# Altium schematic sheet B293A MiRLIN Integrated PIC32.SchDoc
size A3
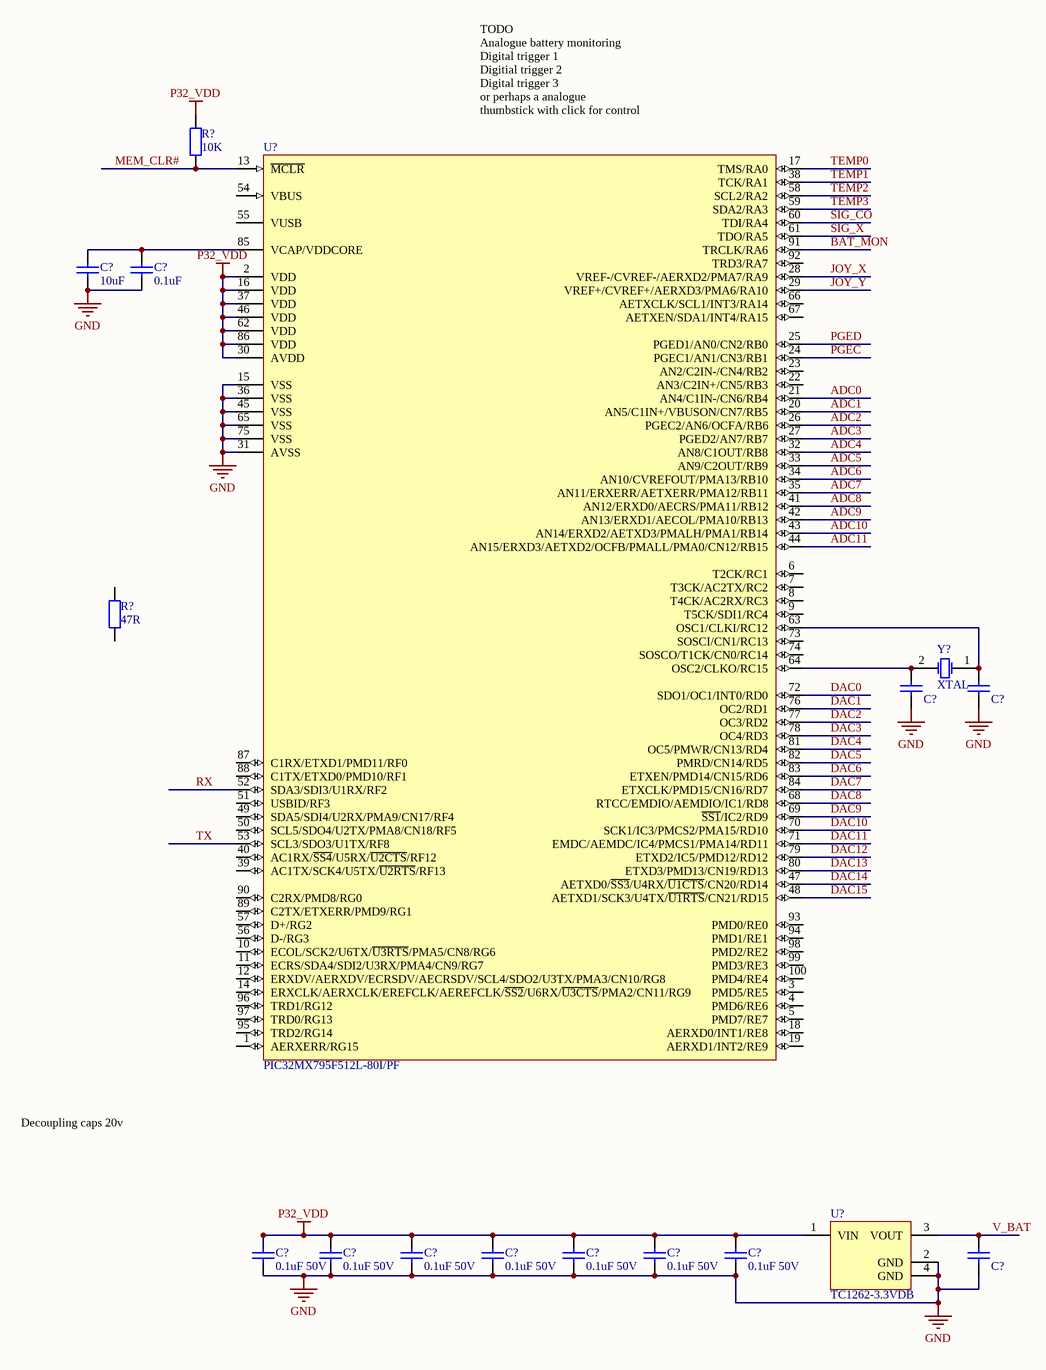
[diagram p0: B293A MiRLIN Integrated PIC32.SchDoc]

## Parts
(Parts that share a designator on the sheet are numbered #1, #2 ... from top to bottom, then left to right.)
C?#1  10uF  [1206]
C?#2  0.1uF  [1206]
C?#3  CAP 18pF 50V 0805(2012)  [CAPC0805(2012)75_M]  (value not drawn)
C?#4  CAP 18pF 50V 0805(2012)  [CAPC0805(2012)75_M]  (value not drawn)
C?#5  0.1uF 50V  [1206]
C?#6  0.1uF 50V  [1206]
C?#7  0.1uF 50V  [1206]
C?#8  0.1uF 50V  [1206]
C?#9  0.1uF 50V  [1206]
C?#10  0.1uF 50V  [1206]
C?#11  0.1uF 50V  [1206]
C?#12  CAP 10uF 16V 1206(3216)  [CAPC1206(3216)130_L]  (value not drawn)
R?#1  10K  [1206]
R?#2  47R  [1206]
U?#1  PIC32MX795F512L-80I/PF  [TQFP-PF100_M]
U?#2  TC1262-3.3VDB  [SOT-223-DB3_L]
Y?  XTAL  [XTL SMD]

## Nets
GND: C?#1.2 C?#2.2 C?#3.1 C?#4.1 C?#5.2 C?#6.2 C?#7.2 C?#8.2 C?#9.2 C?#10.2 C?#11.2 C?#12.2 U?#1.15(VSS) U?#1.31(AVSS) U?#1.36(VSS) U?#1.45(VSS) U?#1.65(VSS) U?#1.75(VSS) U?#2.2(GND) U?#2.4(GND)
P32_VDD: C?#5.1 C?#6.1 C?#7.1 C?#8.1 C?#9.1 C?#10.1 C?#11.1 R?#1.1 U?#1.2(VDD) U?#1.16(VDD) U?#1.30(AVDD) U?#1.37(VDD) U?#1.46(VDD) U?#1.62(VDD) U?#1.86(VDD) U?#2.1(VIN)
ADC0: U?#1.21(AN4/C1IN-/CN6/RB4)
ADC1: U?#1.20(AN5/C1IN+/VBUSON/CN7/RB5)
ADC2: U?#1.26(PGEC2/AN6/OCFA/RB6)
ADC3: U?#1.27(PGED2/AN7/RB7)
ADC4: U?#1.32(AN8/C1OUT/RB8)
ADC5: U?#1.33(AN9/C2OUT/RB9)
ADC6: U?#1.34(AN10/CVREFOUT/PMA13/RB10)
ADC7: U?#1.35(AN11/ERXERR/AETXERR/PMA12/RB11)
ADC8: U?#1.41(AN12/ERXD0/AECRS/PMA11/RB12)
ADC9: U?#1.42(AN13/ERXD1/AECOL/PMA10/RB13)
ADC10: U?#1.43(AN14/ERXD2/AETXD3/PMALH/PMA1/RB14)
ADC11: U?#1.44(AN15/ERXD3/AETXD2/OCFB/PMALL/PMA0/CN12/RB15)
BAT_MON: U?#1.91(TRCLK/RA6)
DAC0: U?#1.72(SDO1/OC1/INT0/RD0)
DAC1: U?#1.76(OC2/RD1)
DAC2: U?#1.77(OC3/RD2)
DAC3: U?#1.78(OC4/RD3)
DAC4: U?#1.81(OC5/PMWR/CN13/RD4)
DAC5: U?#1.82(PMRD/CN14/RD5)
DAC6: U?#1.83(ETXEN/PMD14/CN15/RD6)
DAC7: U?#1.84(ETXCLK/PMD15/CN16/RD7)
DAC8: U?#1.68(RTCC/EMDIO/AEMDIO/IC1/RD8)
DAC9: U?#1.69(~{SS1}/IC2/RD9)
DAC10: U?#1.70(SCK1/IC3/PMCS2/PMA15/RD10)
DAC11: U?#1.71(EMDC/AEMDC/IC4/PMCS1/PMA14/RD11)
DAC12: U?#1.79(ETXD2/IC5/PMD12/RD12)
DAC13: U?#1.80(ETXD3/PMD13/CN19/RD13)
DAC14: U?#1.47(AETXD0/~{SS3}/U4RX/~{U1CTS}/CN20/RD14)
DAC15: U?#1.48(AETXD1/SCK3/U4TX/~{U1RTS}/CN21/RD15)
JOY_X: U?#1.28(VREF-/CVREF-/AERXD2/PMA7/RA9)
JOY_Y: U?#1.29(VREF+/CVREF+/AERXD3/PMA6/RA10)
MEM_CLR#: R?#1.2 U?#1.13(~{MCLR})
PGEC: U?#1.24(PGEC1/AN1/CN3/RB1)
PGED: U?#1.25(PGED1/AN0/CN2/RB0)
RX: U?#1.52(SDA3/SDI3/U1RX/RF2)
SIG_CO: U?#1.60(TDI/RA4)
SIG_X: U?#1.61(TDO/RA5)
TEMP0: U?#1.17(TMS/RA0)
TEMP1: U?#1.38(TCK/RA1)
TEMP2: U?#1.58(SCL2/RA2)
TEMP3: U?#1.59(SDA2/RA3)
TX: U?#1.53(SCL3/SDO3/U1TX/RF8)
V_BAT: C?#12.1 U?#2.3(VOUT)
NetC?#1_1: C?#1.1 C?#2.1 U?#1.85(VCAP/VDDCORE)
NetC?#3_2: C?#3.2 U?#1.64(OSC2/CLKO/RC15) Y?.2(OSC2)
NetC?#4_2: C?#4.2 U?#1.63(OSC1/CLKI/RC12) Y?.1(OSC1)

Not connected (* = marked no-connect by the designer): R?#2 1 2; U?#1 1(AERXERR/RG15) 3(PMD5/RE5) 4(PMD6/RE6) 5(PMD7/RE7) 6(T2CK/RC1) 7(T3CK/AC2TX/RC2) 8(T4CK/AC2RX/RC3) 9(T5CK/SDI1/RC4) 10(ECOL/SCK2/U6TX/~{U3RTS}/PMA5/CN8/RG6) 11(ECRS/SDA4/SDI2/U3RX/PMA4/CN9/RG7) 12(ERXDV/AERXDV/ECRSDV/AECRSDV/SCL4/SDO2/U3TX/PMA3/CN10/RG8) 14(ERXCLK/AERXCLK/EREFCLK/AEREFCLK/~{SS2}/U6RX/~{U3CTS}/PMA2/CN11/RG9) 18(AERXD0/INT1/RE8) 19(AERXD1/INT2/RE9) 22(AN3/C2IN+/CN5/RB3) 23(AN2/C2IN-/CN4/RB2) 39(AC1TX/SCK4/U5TX/~{U2RTS}/RF13) 40(AC1RX/~{SS4}/U5RX/~{U2CTS}/RF12) 49(SDA5/SDI4/U2RX/PMA9/CN17/RF4) 50(SCL5/SDO4/U2TX/PMA8/CN18/RF5) 51(USBID/RF3) 54(VBUS) 55(VUSB) 56(D-/RG3) 57(D+/RG2) 66(AETXCLK/SCL1/INT3/RA14) 67(AETXEN/SDA1/INT4/RA15) 73(SOSCI/CN1/RC13) 74(SOSCO/T1CK/CN0/RC14) 87(C1RX/ETXD1/PMD11/RF0) 88(C1TX/ETXD0/PMD10/RF1) 89(C2TX/ETXERR/PMD9/RG1) 90(C2RX/PMD8/RG0) 92(TRD3/RA7) 93(PMD0/RE0) 94(PMD1/RE1) 95(TRD2/RG14) 96(TRD1/RG12) 97(TRD0/RG13) 98(PMD2/RE2) 99(PMD3/RE3) 100(PMD4/RE4)

## Notes on the sheet
- (near U?#1) TODO
  Analogue battery monitoring
  Digital trigger 1
  Digitial trigger 2
  Digital trigger 3
  or perhaps a analogue thumbstick with click for control
- Decoupling caps 20v
- Title
- Size:
- Date:
- A3
- Number:
- Time:
- Revision:
- Sheet
- of
- File:

## Library data of the parts
C?#1 C?#2 C?#5-C?#11 = CAP: Capacitor
C?#3 C?#4 = CMP-1036-01142-1: CAP 18pF 50V ±5% 0805 (2012 Metric) Thickness 0.75mm SMD; Case-EIA: 0805; Case-Metric: 2012; Value: 18pF; Rated Voltage: 50 V; Tolerance: ±5%; Max Thickness: 0.75 mm; Technology: SMT; Supplier Order Code: 1759194; Supplier: Farnell
C?#12 = CMP-1037-04977-1: CAP 10uF 16V -20% to +80% 1206 (3216 Metric) Thickness 1.3mm SMD; Case-EIA: 1206; Case-Metric: 3216; Rated Voltage: 16 V; Tolerance: -20% to +80%; Technology: SMT; Value: 10uF; Max Thickness: 1.3 mm
R?#1 R?#2 = RES2
U?#1 = CMP-00000-A.1: High Performance 80 MHz MIPS-Based 32-Bit Flash Microcontroller with USB, CAN and Ethernet, 512KB Program Memory, 100-pin TQFP, Industrial Temperature; ComponentLink2Description: Packaging Specification; ComponentLink3URL: http://www.microchip.com/; ComponentLink2URL: http://ww1.microchip.com/downloads/en/PackagingSpec/en012702.pdf; DatasheetVersion: revG, May-2011; ComponentLink1Description: Datasheet; PackageVersion: revBB, Aug-2009; ComponentLink3Description: Microchip.com Home; ComponentLink1URL: http://ww1.microchip.com/downloads/en/DeviceDoc/61156G.pdf; PackageDescription: 100-Lead Thin Plastic Quad Flat Pack (PF) - 14x14x1mm Body, 2.00mm [TQFP]; PackageReference: TQFP-PF100
U?#2 = CMP-0136-00483-1: 500mA Fixed Output CMOS LDO, 3-Pin SOT-223, Extended Temperature; PackageVersion: revBB, Aug-2009; DatasheetVersion: revB, 2002; PackageDescription: 3-Lead Plastic Small Outline Transistor (DB) [SOT-223]; PackageReference: SOT-223-DB3
Y? = XTAL: Crystal Oscillator; Manufacturer Part Number: 9C-8.000MEEJ-T; Published: 8-Jun-2000; LatestRevisionDate: 17-Jul-2002; LatestRevisionNote: Re-released for DXP Platform.; PackageReference: R38; Publisher: Altium Limited; PackageDescription: Crystal, Thru-Hole; 2 Leads; Body 3.1 x 8.2 mm (Dia.xH); Supplier Code: 1842347